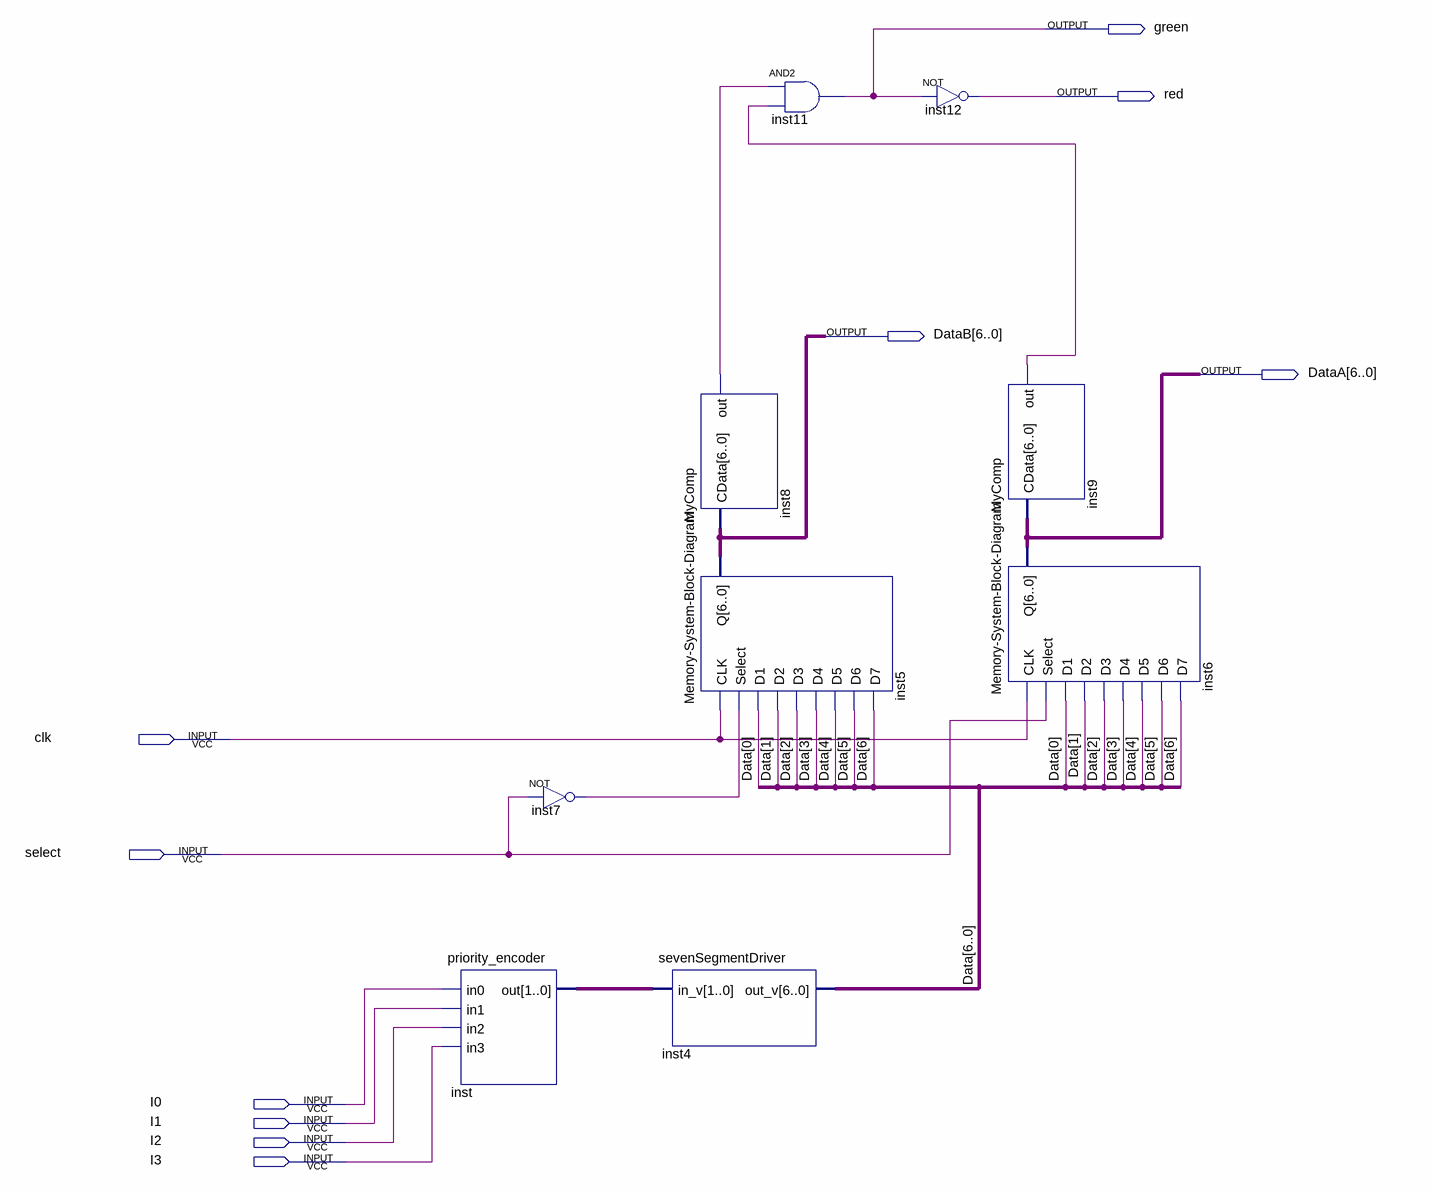
[diagram p0: schematic sheet]
// Quartus schematic ComputerSecurity.bdf as structural Verilog: 9 symbols, 10 pins
module ComputerSecurity (
  input  clk,
  input  select,
  input  I0,
  input  I1,
  input  I2,
  input  I3,
  output green,
  output red,
  output [6:0] DataB,
  output [6:0] DataA
);

  wire inst7_out, inst8_out, inst9_out;
  wire [1:0] inst_out;
  wire [6:0] Data;

  priority_encoder inst (.in0(I0), .in1(I1), .in2(I2), .in3(I3), .out(inst_out));
  not inst7 (inst7_out, select);
  MyComp inst8 (.CData(DataB), .out(inst8_out));
  \Memory-System-Block-Diagram  inst5 (
    .CLK(clk), .Select(inst7_out), .D1(Data[0]), .D2(Data[1]), .D3(Data[2]), .D4(Data[3]), .D5(Data[4]),
    .D6(Data[5]), .D7(Data[6]), .Q(DataB));
  sevenSegmentDriver inst4 (.in_v(inst_out), .out_v(Data));
  and inst11 (green, inst8_out, inst9_out);
  not inst12 (red, green);
  MyComp inst9 (.CData(DataA), .out(inst9_out));
  \Memory-System-Block-Diagram  inst6 (
    .CLK(clk), .Select(select), .D1(Data[0]), .D2(Data[1]), .D3(Data[2]), .D4(Data[3]), .D5(Data[4]),
    .D6(Data[5]), .D7(Data[6]), .Q(DataA));
endmodule
